# Altium schematic sheet Power1.SchDoc
size A4
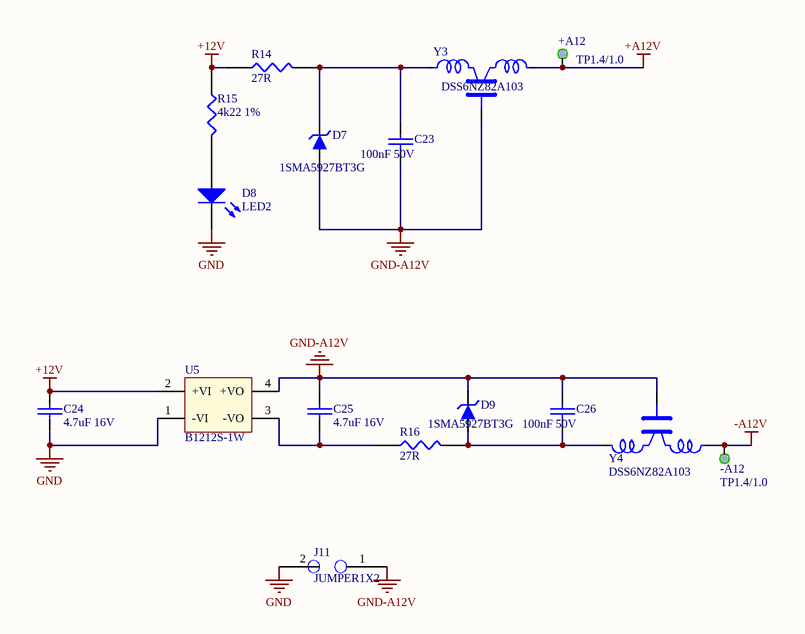
[diagram p0: Power1.SchDoc]

## Parts
+A12  TP1.4/1.0  [TP1.4/1.0]  (no BOM)
-A12  TP1.4/1.0  [TP1.4/1.0]  (no BOM)
C23  100nF 50V  [CAPC2012N]
C24  4.7uF 16V  [CAPC2012N]
C25  4.7uF 16V  [CAPC2012N]
C26  100nF 50V  [CAPC2012N]
D7  1SMA5927BT3G  [DSO-C2/X1.8]
D8  LED2  [3.2X1.6X1.1]
D9  1SMA5927BT3G  [DSO-C2/X1.8]
J11  JUMPER1X2  [JP-SOLDER-H1X2-3X2]  (no BOM)
R14  27R  [RESC3216N]
R15  4k22 1%  [RESC2012N]
R16  27R  [RESC3216N]
U5  B1212S-1W  [B0505S-W1]
Y3  DSS6NZ82A103  [DSS6]
Y4  DSS6NZ82A103  [DSS6]

## Nets
+12V: C24.1 R14.1 R15.1 U5.2(+VI)
+A12V: +A12.1 Y3.3
-A12V: -A12.1 Y4.1
GND: C24.2 D8.2(K) J11.2 U5.1(-VI)
GND-A12V: C23.1 C25.1 C26.2 D7.1(A) D9.2(K) J11.1 U5.4(+VO) Y3.2 Y4.2
NetC23_2: C23.2 D7.2(K) R14.2 Y3.1
NetC25_2: C25.2 R16.1 U5.3(-VO)
NetC26_1: C26.1 D9.1(A) R16.2 Y4.3
NetD8_1: D8.1(A) R15.2

## Library data of the parts
C23 C26 = CAP: Price: 0.025
C24 C25 = CAP: Capacitor; Price: 0.025
D7 D9 = Zener unidirectional: Zener diode; Manufacturer: ON; Price: 2.5
D8 = LED2: Typical RED, GREEN, YELLOW, AMBER GaAs LED; Published: 8-Jun-2000; LatestRevisionDate: 17-Jul-2002; LatestRevisionNote: Re-released for DXP Platform.; PackageDocument: Feb-2002; PackageReference: 3.2X1.6X1.1; Publisher: Altium Limited
R14-R16 = RES1
U5 = B0505S-1W: 12V isolated DC-DC converter; Price: 4.5
Y3 Y4 = DSS6: Murata EMI suppression filter; Manufacturer: Murata; Price: 0.5